# Altium project PIF_DRV.PrjPCB
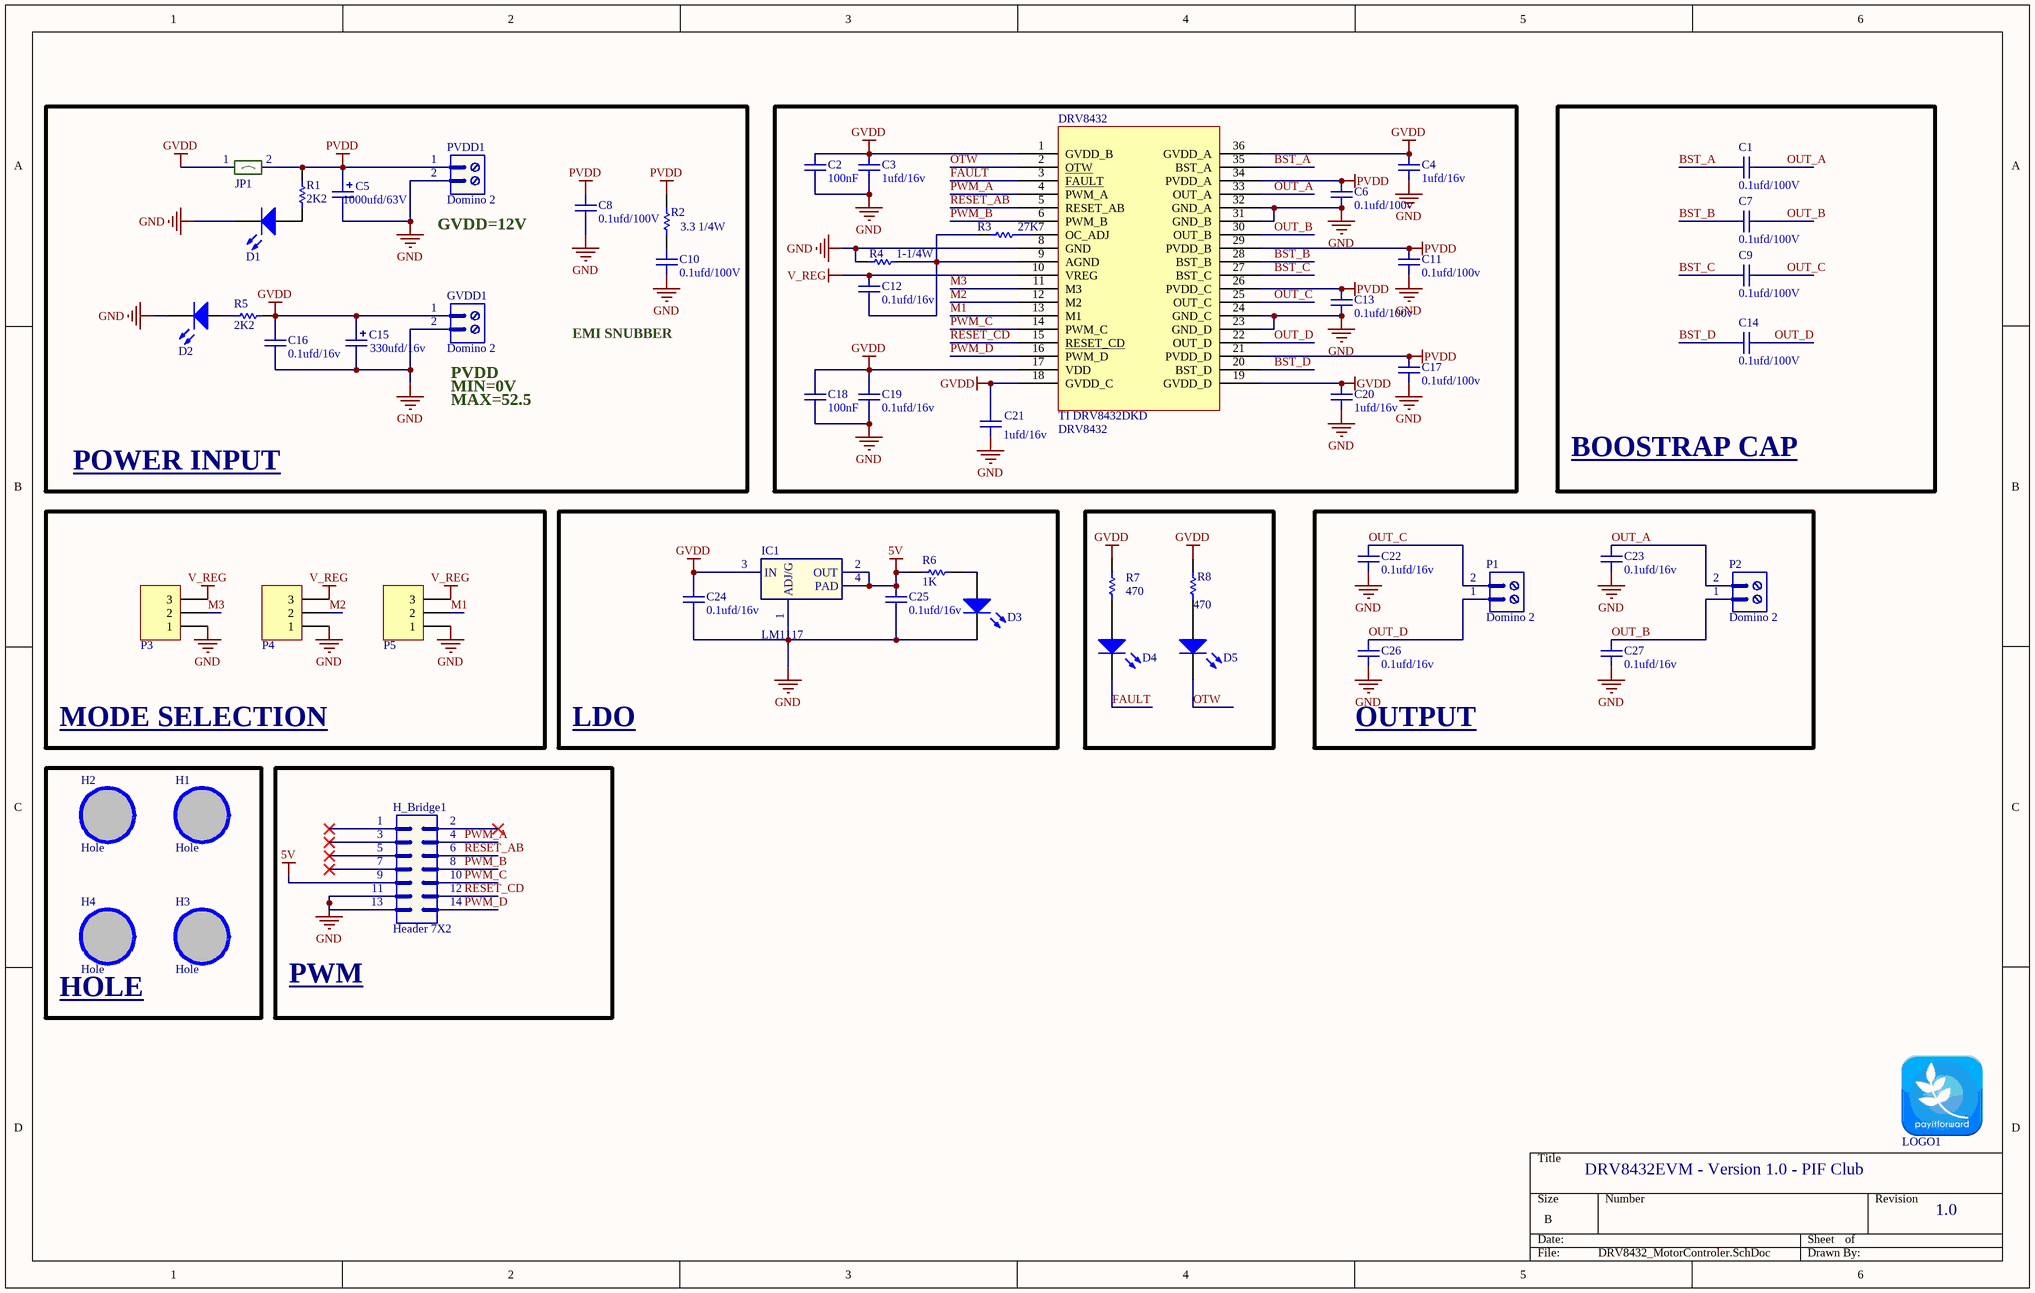
[diagram p0: DRV8432_MotorControler.SchDoc]
1 sheet, 56 parts. Net scope: global (net labels, ports and power ports of the same name join across sheets).
Board file: DRV8432_MotorControler.PcbDoc

## Sheet DRV8432_MotorControler.SchDoc
size B

### Parts
C1  value 0.1ufd/100V  [CAP-SM-0805]  (hidden comment: Cap Non-Pol SMD)
C2  value 100nF  [CAP-SM-1210]  (hidden comment: Cap Non-Pol SMD)
C3  value 1ufd/16v  [CAP-SM-0603]  (hidden comment: Cap Non-Pol SMD)
C4  value 1ufd/16v  [CAP-SM-0603]  (hidden comment: Cap Non-Pol SMD)
C5  value 1000ufd/63V  [CP3/7]  (hidden comment: Cap Pol)
C6  value 0.1ufd/100v  [CAP-SM-0805]  (hidden comment: Cap Non-Pol SMD)
C7  value 0.1ufd/100V  [CAP-SM-0805]  (hidden comment: Cap Non-Pol SMD)
C8  value 0.1ufd/100V  [CAP-SM-0805]  (hidden comment: Cap Non-Pol SMD)
C9  value 0.1ufd/100V  [CAP-SM-0805]  (hidden comment: Cap Non-Pol SMD)
C10  value 0.1ufd/100V  [CAP-SM-0805]  (hidden comment: Cap Non-Pol SMD)
C11  value 0.1ufd/100v  [CAP-SM-0805]  (hidden comment: Cap Non-Pol SMD)
C12  value 0.1ufd/16v  [CAP-SM-0603]  (hidden comment: Cap Non-Pol SMD)
C13  value 0.1ufd/100v  [CAP-SM-0805]  (hidden comment: Cap Non-Pol SMD)
C14  value 0.1ufd/100V  [CAP-SM-0805]  (hidden comment: Cap Non-Pol SMD)
C15  value 330ufd/16v  [CP1/2.5]  (hidden comment: Cap Pol)
C16  value 0.1ufd/16v  [CAP-SM-0805]  (hidden comment: Cap Non-Pol SMD)
C17  value 0.1ufd/100v  [CAP-SM-0805]  (hidden comment: Cap Non-Pol SMD)
C18  value 100nF  [CAP-SM-1210]  (hidden comment: Cap Non-Pol SMD)
C19  value 0.1ufd/16v  [CAP-SM-0805]  (hidden comment: Cap Non-Pol SMD)
C20  value 1ufd/16v  [CAP-SM-0603]  (hidden comment: Cap Non-Pol SMD)
C21  value 1ufd/16v  [CAP-SM-0603]  (hidden comment: Cap Non-Pol SMD)
C22  value 0.1ufd/16v  [CAP-SM-0805]  (hidden comment: Cap Non-Pol SMD)
C23  value 0.1ufd/16v  [CAP-SM-0805]  (hidden comment: Cap Non-Pol SMD)
C24  value 0.1ufd/16v  [CAP-SM-0805]  (hidden comment: Cap Non-Pol SMD)
C25  value 0.1ufd/16v  [CAP-SM-0805]  (hidden comment: Cap Non-Pol SMD)
C26  value 0.1ufd/16v  [CAP-SM-0805]  (hidden comment: Cap Non-Pol SMD)
C27  value 0.1ufd/16v  [CAP-SM-0805]  (hidden comment: Cap Non-Pol SMD)
D1  LED SMD  [LED_0603_Blue]  (value not drawn)
D2  LED SMD  [LED_0603_Blue]  (value not drawn)
D3  LED SMD  [LED_0603_Blue]  (value not drawn)
D4  LED SMD  [LED_0603_Blue]  (value not drawn)
D5  LED SMD  [LED_0603_Blue]  (value not drawn)
DRV8432  DRV8432  [PCBComponent_1]
GVDD1  Domino 2  [DOMINO 2- 5mm]
H1  Hole  [LO KHOAN 3MM]
H2  Hole  [LO KHOAN 3MM]
H3  Hole  [LO KHOAN 3MM]
H4  Hole  [LO KHOAN 3MM]
H_Bridge1  Header 7X2  [JP7X2]
IC1  LM1117  [SOT223-4N]
JP1  Jumper 2  [JP2]  (value not drawn)
LOGO1  LOGO PIF  [PIF LOGO TOP OVERLAY]  (value not drawn)
P1  Domino 2  [DOMINO 2- 5mm]
P2  Domino 2  [DOMINO 2- 5mm]
P3  Header 3  [JP3]  (value not drawn)
P4  Header 3  [JP3]  (value not drawn)
P5  Header 3  [JP3]  (value not drawn)
PVDD1  Domino 2  [DOMINO 2- 5mm]
R1  value 2K2  [RES-SM-0603]  (hidden comment: RESISTOR SMD)
R2  value 3.3 1/4W  [RES-SM-1206]  (hidden comment: RESISTOR SMD)
R3  value 27K  [RES-SM-0603]  (hidden comment: RESISTOR SMD)
R4  value 1-1/4W  [RES-SM-0805]  (hidden comment: RESISTOR SMD)
R5  value 2K2  [RES-SM-0603]  (hidden comment: RESISTOR SMD)
R6  value 1K  [RES-SM-0603]  (hidden comment: RESISTOR SMD)
R7  value 470  [RES-SM-0603]  (hidden comment: RESISTOR SMD)
R8  value 470  [RES-SM-0603]  (hidden comment: RESISTOR SMD)

### Blocks framed on the sheet
POWER INPUT: C5 C8 C10 C15 C16 D1 D2 GVDD1 JP1 PVDD1 R1 R2 R5
BOOSTRAP CAP: C1 C7 C9 C14
MODE SELECTION: P3-P5
LDO: C24 C25 D3 IC1 R6
OUTPUT: C22 C23 C26 C27 P1 P2
HOLE: H1-H4
PWM: H_Bridge1

### Nets
5V: C25.2 H_Bridge1.9 IC1.2(OUT) IC1.4(PAD) R6.2
GND: C2.1 C3.2 C4.2 C5.2 C6.1 C8.1 C10.1 C11.1 C13.1 C15.2 C16.1 C17.1 C18.1 C19.1 C20.1 C21.1 C22.1 C23.1 C24.1 C25.1 C26.1 C27.1 D1.2(K) D2.2(K) D3.2(K) DRV8432.8(GND) DRV8432.23(GND_D) DRV8432.24(GND_C) DRV8432.31(GND_B) DRV8432.32(GND_A) GVDD1.2 H_Bridge1.11 H_Bridge1.13 IC1.1(ADJ/G) P3.1 P4.1 P5.1 PVDD1.2 R4.2
GVDD: C2.2 C3.1 C4.1 C15.1 C16.2 C18.2 C19.2 C20.2 C21.2 C24.2 DRV8432.1(GVDD_B) DRV8432.17(VDD) DRV8432.18(GVDD_C) DRV8432.19(GVDD_D) DRV8432.36(GVDD_A) GVDD1.1 IC1.3(IN) JP1.1 R5.2 R7.2 R8.2
PVDD: C5.1 C6.2 C8.2 C11.2 C13.2 C17.2 DRV8432.21(PVDD_D) DRV8432.26(PVDD_C) DRV8432.29(PVDD_B) DRV8432.34(PVDD_A) JP1.2 PVDD1.1 R1.2 R2.2
V_REG: C12.1 DRV8432.10(VREG) P3.3 P4.3 P5.3
BST_A: C1.1 DRV8432.35(BST_A)
BST_B: C7.1 DRV8432.28(BST_B)
BST_C: C9.1 DRV8432.27(BST_C)
BST_D: C14.1 DRV8432.20(BST_D)
FAULT: D4.2(K) DRV8432.3(FAULT)
M1: DRV8432.13(M1) P5.2
M2: DRV8432.12(M2) P4.2
M3: DRV8432.11(M3) P3.2
OTW: D5.2(K) DRV8432.2(OTW)
OUT_A: C1.2 C23.2 DRV8432.33(OUT_A) P2.2
OUT_B: C7.2 C27.2 DRV8432.30(OUT_B) P2.1
OUT_C: C9.2 C22.2 DRV8432.25(OUT_C) P1.2
OUT_D: C14.2 C26.2 DRV8432.22(OUT_D) P1.1
PWM_A: DRV8432.4(PWM_A) H_Bridge1.4
PWM_B: DRV8432.6(PWM_B) H_Bridge1.8
PWM_C: DRV8432.14(PWM_C) H_Bridge1.10
PWM_D: DRV8432.16(PWM_D) H_Bridge1.14
RESET_AB: DRV8432.5(RESET_AB) H_Bridge1.6
RESET_CD: DRV8432.15(RESET_CD) H_Bridge1.12
NetC10_2: C10.2 R2.1
NetC12_2: C12.2 DRV8432.9(AGND) R3.2 R4.1
NetD1_1: D1.1(A) R1.1
NetD2_1: D2.1(A) R5.1
NetD3_1: D3.1(A) R6.1
NetD4_1: D4.1(A) R7.1
NetD5_1: D5.1(A) R8.1
NetDRV8432_7: DRV8432.7(OC_ADJ) R3.1

Not connected (* = marked no-connect by the designer): H1 1; H2 1; H3 1; H4 1; H_Bridge1 1* 2* 3* 5* 7*

### Notes on the sheet
- (near PVDD1) GVDD=12V
- EMI SNUBBER
- (near GVDD1) PVDD
- (near GVDD1) MIN=0V
- MAX=52.5
- (near LOGO1) DRV8432EVM - Version 1.0 - PIF Club
- 1.0
- (in symbol Component_1) TI DRV8432DKD

### Library data of the parts
C1-C4 C6-C14 C16-C27 = Cap Non-Pol SMD: Capacitor
C5 C15 = Cap Pol: Polarized Capacitor (Radial)
D1-D5 = LED SMD: LED
DRV8432 = Component_1
GVDD1 P1 P2 PVDD1 = Domino 2: Domino, 2-Pin; LatestRevisionDate: 17-Jul-2002; LatestRevisionNote: Re-released for DXP Platform.; Publisher: Altium Limited
H1-H4 = Hole: Hole 3mm
H_Bridge1 = Header 7X2: Header, 7-Pin, Dual row; LatestRevisionDate: 17-Jul-2002; LatestRevisionNote: Re-released for DXP Platform.; Publisher: Altium Limited
IC1 = LM1117: Available in 1.8V, 2.5V, 2.85V, 3.3V, 5V, and  Adjustable Versions; Value: LM317
P3-P5 = Header 3: Header, 3-Pin; LatestRevisionDate: 17-Jul-2002; LatestRevisionNote: Re-released for DXP Platform.; Publisher: Altium Limited
R1-R8 = RESISTOR SMD: Resistor